# Altium schematic sheet 05-ORStatusLed.SchDoc
size A4; DocumentNumber: 5; SheetNumber: 5; SheetTotal: 26
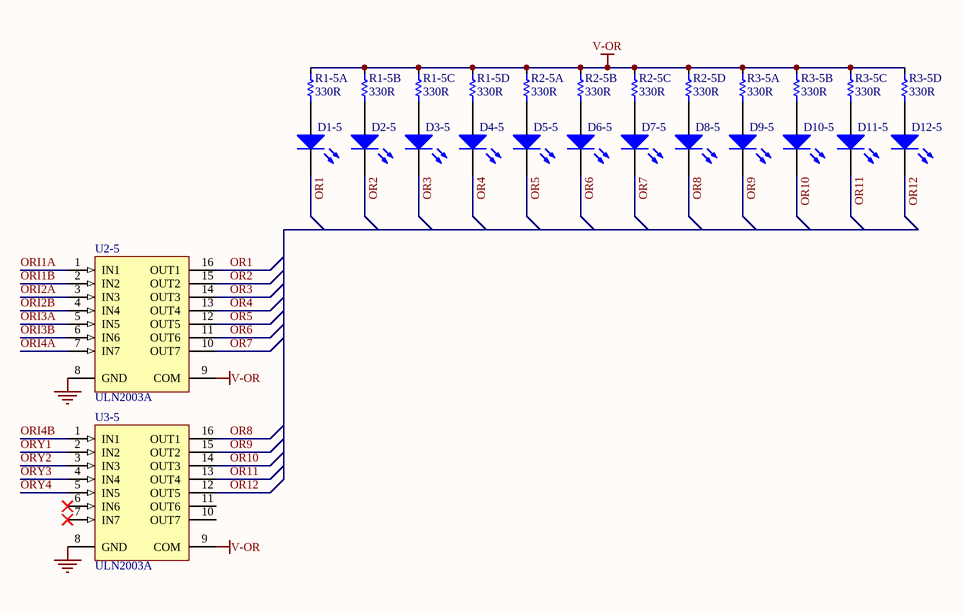
[diagram p0: 05-ORStatusLed.SchDoc]

## Parts
D1-5  LED  [LED-0805]  (value not drawn)
D2-5  LED  [LED-0805]  (value not drawn)
D3-5  LED  [LED-0805]  (value not drawn)
D4-5  LED  [LED-0805]  (value not drawn)
D5-5  LED  [LED-0805]  (value not drawn)
D6-5  LED  [LED-0805]  (value not drawn)
D7-5  LED  [LED-0805]  (value not drawn)
D8-5  LED  [LED-0805]  (value not drawn)
D9-5  LED  [LED-0805]  (value not drawn)
D10-5  LED  [LED-0805]  (value not drawn)
D11-5  LED  [LED-0805]  (value not drawn)
D12-5  LED  [LED-0805]  (value not drawn)
R1-5  330R  [R-Array-0603-4]  (parts A,B,C,D of 4)
R2-5  330R  [R-Array-0603-4]  (parts A,B,C,D of 4)
R3-5  330R  [R-Array-0603-4]  (parts A,B,C,D of 4)
U2-5  ULN2003A  [SOIC-16]
U3-5  ULN2003A  [SOIC-16]

## Nets
GND: U2-5.8(GND) U3-5.8(GND)
V-OR: R1-5.2 R1-5.4 R1-5.6 R1-5.8 R2-5.2 R2-5.4 R2-5.6 R2-5.8 R3-5.2 R3-5.4 R3-5.6 R3-5.8 U2-5.9(COM) U3-5.9(COM)
OR1: D1-5.2(K) U2-5.16(OUT1)
OR2: D2-5.2(K) U2-5.15(OUT2)
OR3: D3-5.2(K) U2-5.14(OUT3)
OR4: D4-5.2(K) U2-5.13(OUT4)
OR5: D5-5.2(K) U2-5.12(OUT5)
OR6: D6-5.2(K) U2-5.11(OUT6)
OR7: D7-5.2(K) U2-5.10(OUT7)
OR8: D8-5.2(K) U3-5.16(OUT1)
OR9: D9-5.2(K) U3-5.15(OUT2)
OR10: D10-5.2(K) U3-5.14(OUT3)
OR11: D11-5.2(K) U3-5.13(OUT4)
OR12: D12-5.2(K) U3-5.12(OUT5)
ORI1A: U2-5.1(IN1)
ORI1B: U2-5.2(IN2)
ORI2A: U2-5.3(IN3)
ORI2B: U2-5.4(IN4)
ORI3A: U2-5.5(IN5)
ORI3B: U2-5.6(IN6)
ORI4A: U2-5.7(IN7)
ORI4B: U3-5.1(IN1)
ORY1: U3-5.2(IN2)
ORY2: U3-5.3(IN3)
ORY3: U3-5.4(IN4)
ORY4: U3-5.5(IN5)
NetD1-5_1: D1-5.1(A) R1-5.1
NetD2-5_1: D2-5.1(A) R1-5.3
NetD3-5_1: D3-5.1(A) R1-5.5
NetD4-5_1: D4-5.1(A) R1-5.7
NetD5-5_1: D5-5.1(A) R2-5.1
NetD6-5_1: D6-5.1(A) R2-5.3
NetD7-5_1: D7-5.1(A) R2-5.5
NetD8-5_1: D8-5.1(A) R2-5.7
NetD9-5_1: D9-5.1(A) R3-5.1
NetD10-5_1: D10-5.1(A) R3-5.3
NetD11-5_1: D11-5.1(A) R3-5.5
NetD12-5_1: D12-5.1(A) R3-5.7

Not connected (* = marked no-connect by the designer): U3-5 6(IN6)* 7(IN7)* 10(OUT7) 11(OUT6)

## Library data of the parts
D1-5 D2-5 D3-5 D4-5 D5-5 D6-5 D7-5 D8-5 D9-5 D10-5 D11-5 D12-5 = LED2: Typical RED, GREEN, YELLOW, AMBER GaAs LED; Published: 8-Jun-2000; LatestRevisionDate: 17-Jul-2002; LatestRevisionNote: Re-released for DXP Platform.; PackageVersion: Feb-2002; PackageReference: 3.2X1.6X1.1; Publisher: Altium Limited; PackageDescription: SM LED; 2 Flat Leads
R1-5 R2-5 R3-5 = Res Array 4: RES ARRAY 4 RES 330 OHM 1206; Manufacturer: Panasonic Electronic Components; Manufacturer Part Number: EXB-38V331JV; Digi-Key Part Number: Y9331TR-ND; Link: http://www.digikey.com/product-detail/en/EXB-38V331JV/Y9331TR-ND/256525
U2-5 U3-5 = ULN2003A: High-Voltage, High-Current Darlington Array; Published: 13-Oct-2000; LatestRevisionDate: 06-Jun-2005; LatestRevisionNote: Stylized 3D Model Added.; DatasheetVersion: 1998; PackageVersion: 1998; PackageReference: A16; Publisher: Altium Limited; PackageDescription: DIP; 16 Leads; Row Spacing 7.62 mm; Pitch 2.54 mm; Code_JEDEC: MS-001-BB; ComponentLink1Description: Manufacturer Link; ComponentLink1URL: http://www.allegromicro.com/